# Altium schematic sheet SMI_Link_7-12.SchDoc
size A4
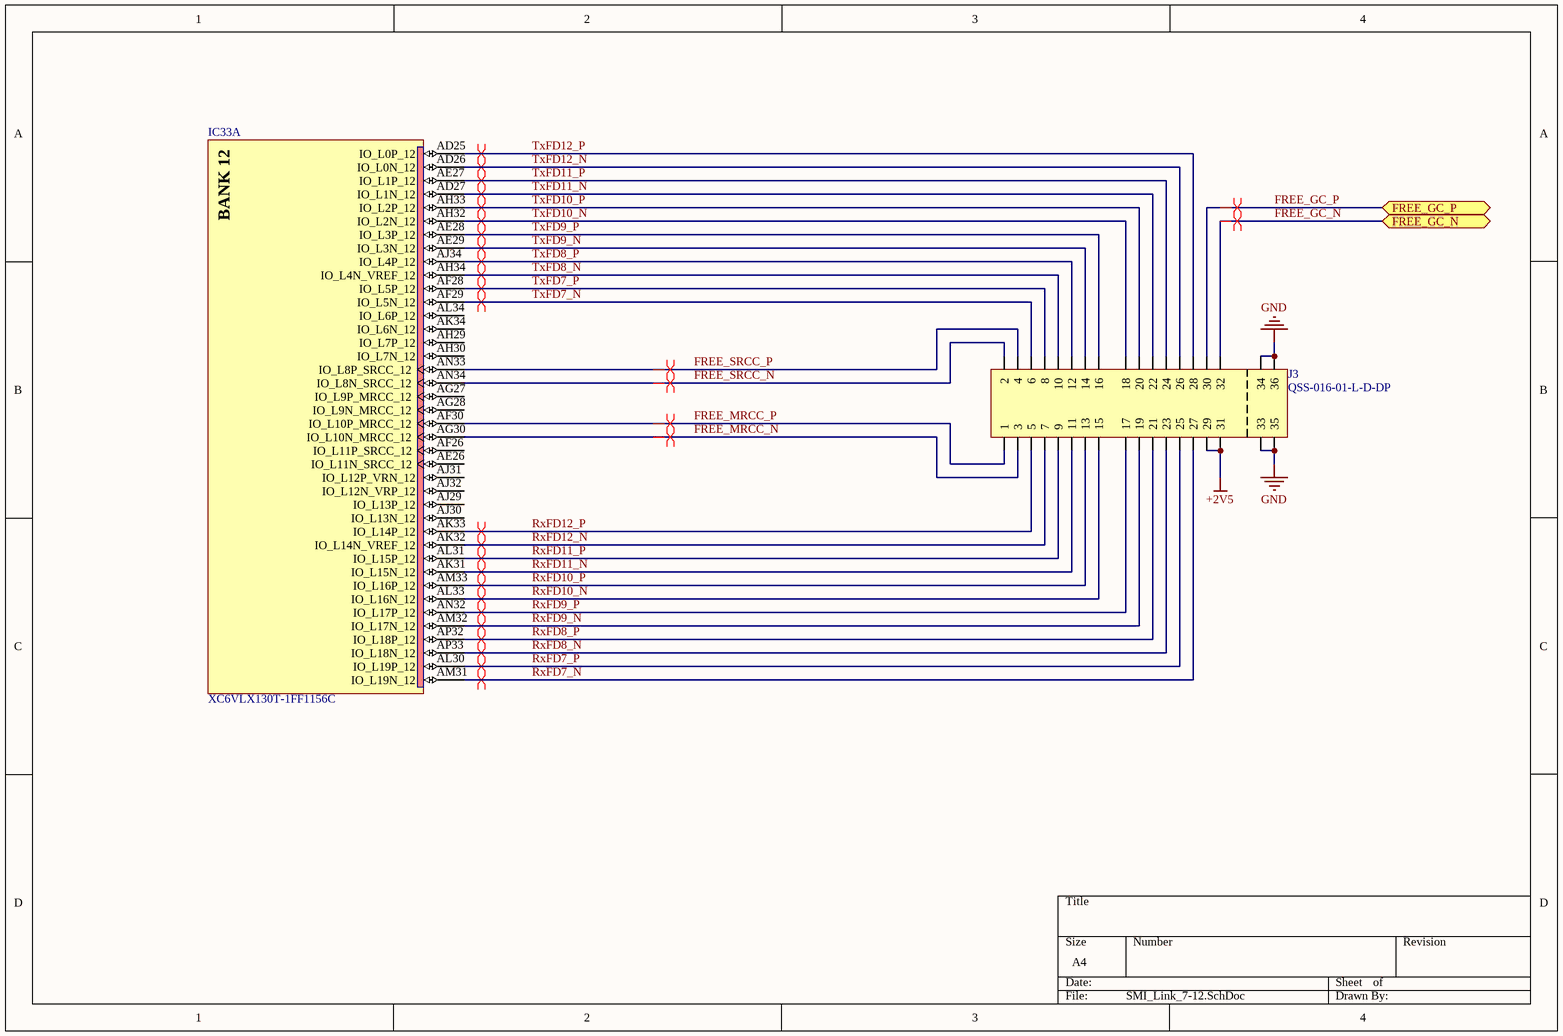
[diagram p0: SMI_Link_7-12.SchDoc]

## Parts
IC33  XC6VLX130T-1FF1156C  [FF1156]  (part A of 20)
J3  QSS-016-01-L-D-DP  [QSS-016-01-X-D-DP-A]

## Ports
FREE_GC_N (bidir), FREE_GC_P (bidir)

## Nets
+2V5: J3.29 J3.31
GND: J3.33 J3.34 J3.35 J3.36
FREE_GC_N: J3.32 ; port FREE_GC_N
FREE_GC_P: J3.30 ; port FREE_GC_P
FREE_MRCC_N: IC33.AG30(IO_L10N_MRCC_12) J3.3
FREE_MRCC_P: IC33.AF30(IO_L10P_MRCC_12) J3.1
FREE_SRCC_N: IC33.AN34(IO_L8N_SRCC_12) J3.2
FREE_SRCC_P: IC33.AN33(IO_L8P_SRCC_12) J3.4
RxFD7_N: IC33.AM31(IO_L19N_12) J3.27
RxFD7_P: IC33.AL30(IO_L19P_12) J3.25
RxFD8_N: IC33.AP33(IO_L18N_12) J3.23
RxFD8_P: IC33.AP32(IO_L18P_12) J3.21
RxFD9_N: IC33.AM32(IO_L17N_12) J3.19
RxFD9_P: IC33.AN32(IO_L17P_12) J3.17
RxFD10_N: IC33.AL33(IO_L16N_12) J3.15
RxFD10_P: IC33.AM33(IO_L16P_12) J3.13
RxFD11_N: IC33.AK31(IO_L15N_12) J3.11
RxFD11_P: IC33.AL31(IO_L15P_12) J3.9
RxFD12_N: IC33.AK32(IO_L14N_VREF_12) J3.7
RxFD12_P: IC33.AK33(IO_L14P_12) J3.5
TxFD7_N: IC33.AF29(IO_L5N_12) J3.6
TxFD7_P: IC33.AF28(IO_L5P_12) J3.8
TxFD8_N: IC33.AH34(IO_L4N_VREF_12) J3.10
TxFD8_P: IC33.AJ34(IO_L4P_12) J3.12
TxFD9_N: IC33.AE29(IO_L3N_12) J3.14
TxFD9_P: IC33.AE28(IO_L3P_12) J3.16
TxFD10_N: IC33.AH32(IO_L2N_12) J3.18
TxFD10_P: IC33.AH33(IO_L2P_12) J3.20
TxFD11_N: IC33.AD27(IO_L1N_12) J3.22
TxFD11_P: IC33.AE27(IO_L1P_12) J3.24
TxFD12_N: IC33.AD26(IO_L0N_12) J3.26
TxFD12_P: IC33.AD25(IO_L0P_12) J3.28

Not connected (* = marked no-connect by the designer): IC33 AE26(IO_L11N_SRCC_12) AF26(IO_L11P_SRCC_12) AG27(IO_L9P_MRCC_12) AG28(IO_L9N_MRCC_12) AH29(IO_L7P_12) AH30(IO_L7N_12) AJ29(IO_L13P_12) AJ30(IO_L13N_12) AJ31(IO_L12P_VRN_12) AJ32(IO_L12N_VRP_12) AK34(IO_L6N_12) AL34(IO_L6P_12)

## Layout directives
differential pair: FREE_GC_N, FREE_GC_P, FREE_MRCC_N, FREE_MRCC_P, FREE_SRCC_N, FREE_SRCC_P, RxFD7_N, RxFD7_P, RxFD8_N, RxFD8_P, RxFD9_N, RxFD9_P, RxFD10_N, RxFD10_P, RxFD11_N, RxFD11_P, RxFD12_N, RxFD12_P, TxFD7_N, TxFD7_P, TxFD8_N, TxFD8_P, TxFD9_N, TxFD9_P, TxFD10_N, TxFD10_P, TxFD11_N, TxFD11_P, TxFD12_N, TxFD12_P

## Notes on the sheet
- (in symbol XC6VLX130T-1FF1156C, part A) BANK 12

## Library data of the parts
IC33 = XC6VLX130T-1FF1156C: Virtex-6 LXT Platform FPGA, 600 User I/Os, 20 GTXs, 1156-Ball FFBGA, Speed Grade 1, Commercial Grade; FirstPublished: 17-Nov-2009; DatasheetVersion: v2.0, Sep-2009; PackageVersion: ver1.0, Jun-2009; PackageReference: FF1156; Publisher: Altium Limited; PackageDescription: 1156-Ball Flip-Chip Fine Pitch Ball Grid Array (FF1156); Code_JEDEC: MS-034-AAR-1; Code_IPC: BGA100P34X34-1156; ComponentLink1Description: Virtex-6 Datasheet; ComponentLink1URL: http://www.xilinx.com/support/documentation/data_sheets/ds150.pdf; ComponentLink2Description: Pinout Specification; ComponentLink2URL: http://www.xilinx.com/support/packagefiles/virtex-6-pkgs.htm; ComponentLink3Description: FF1156 Package Drawing; ComponentLink3URL: http://www.xilinx.com/support/documentation/package_specs/ff1156.pdf; ComponentLink4Description: Virtex-6 Documents; ComponentLink4URL: http://www.xilinx.com/support/documentation/virtex-6.htm; ComponentLink5Description: Xilinx.com Home; ComponentLink5URL: http://www.xilinx.com